# EAGLE schematic AlarmClock (EAGLE 9.6.2)
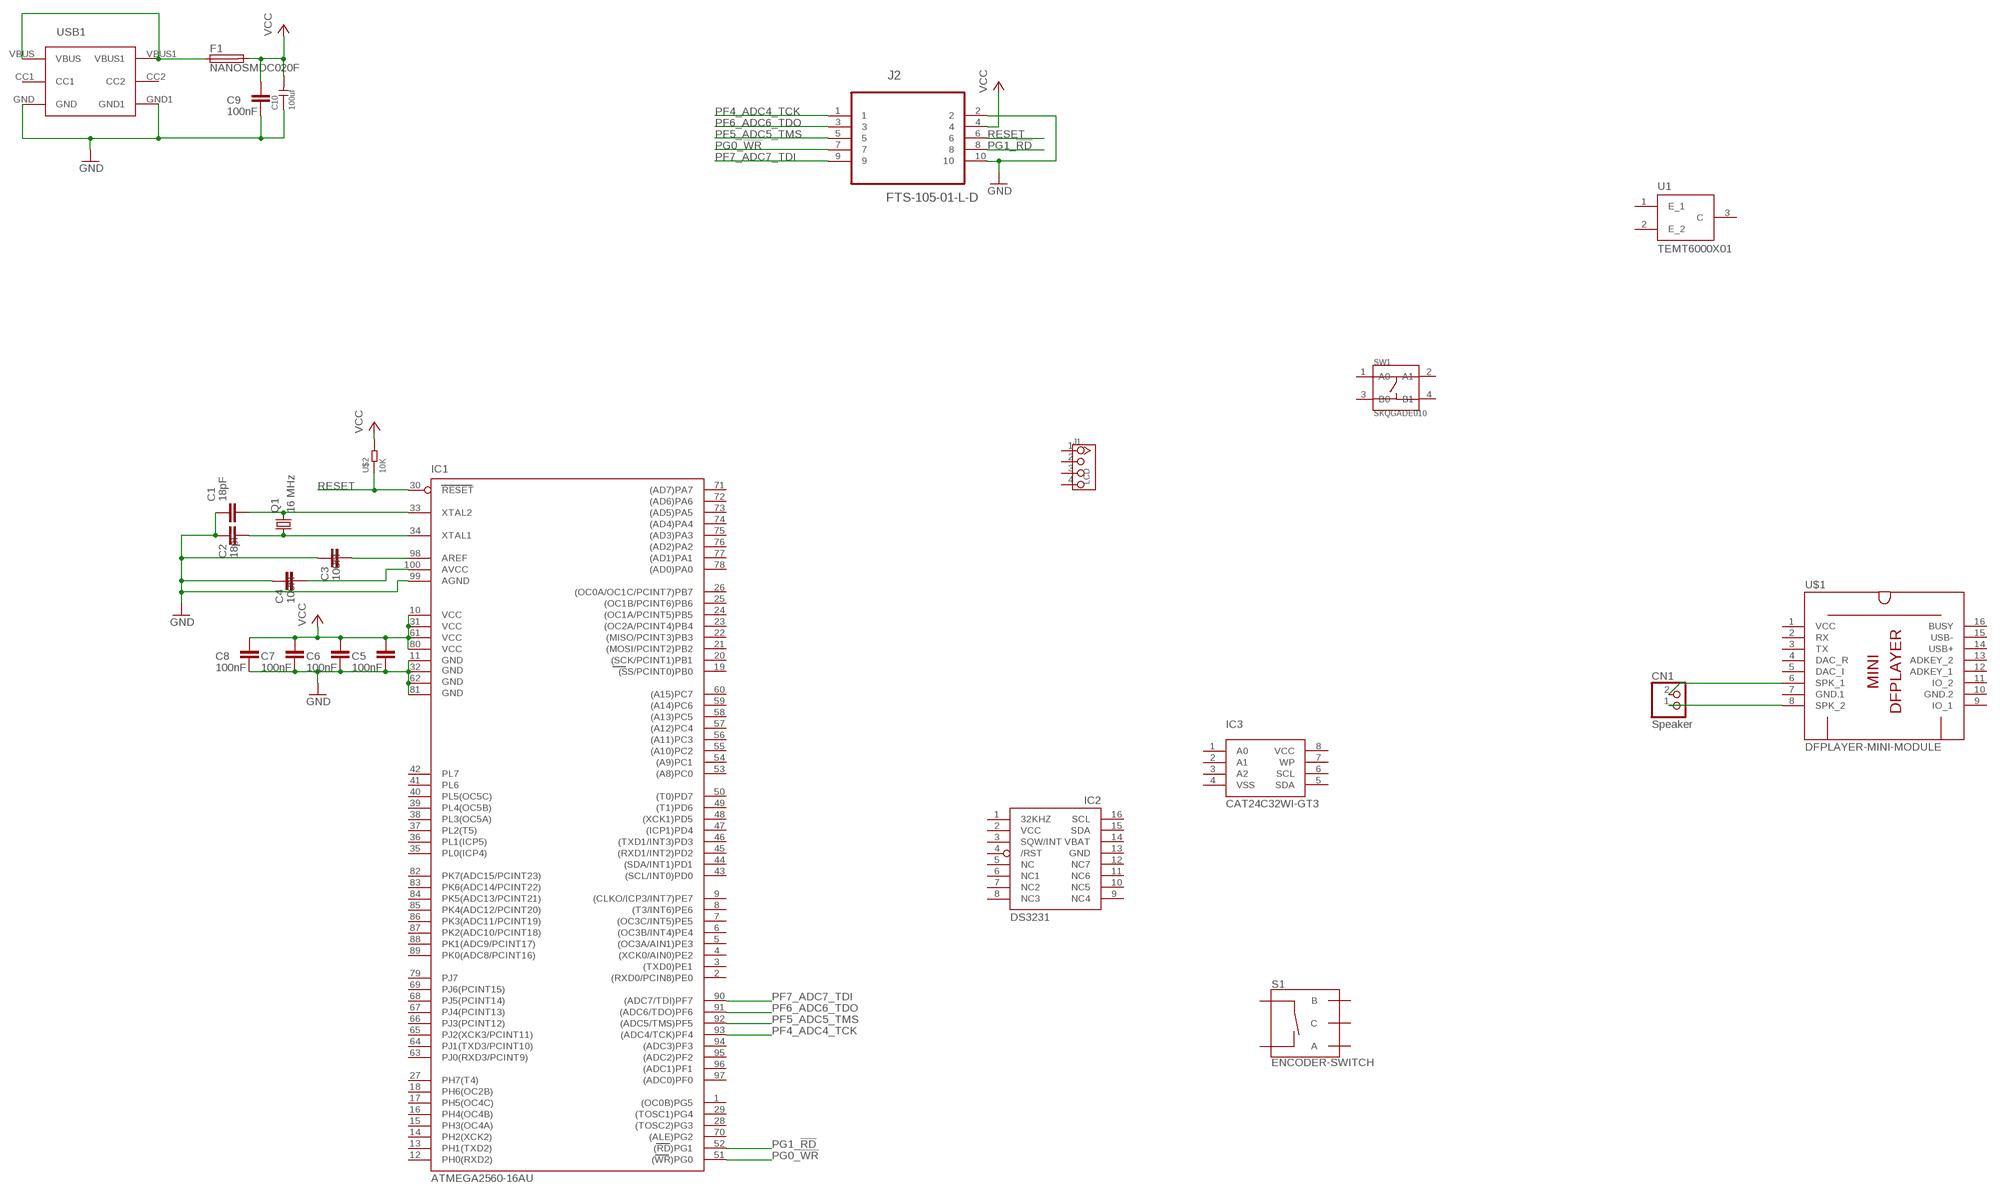
[diagram p0: schematic, sheet 1]

## Parts
C1  18pF  C_CHIP-0805(2012-METRIC)  [CAPC2012X110]
C2  18pF  C_CHIP-0805(2012-METRIC)  [CAPC2012X110]
C3  100nF  C_CHIP-0805(2012-METRIC)  [CAPC2012X110]
C4  100nF  C_CHIP-0805(2012-METRIC)  [CAPC2012X110]
C5  100nF  C_CHIP-0805(2012-METRIC)  [CAPC2012X110]
C6  100nF  C_CHIP-0805(2012-METRIC)  [CAPC2012X110]
C7  100nF  C_CHIP-0805(2012-METRIC)  [CAPC2012X110]
C8  100nF  C_CHIP-0805(2012-METRIC)  [CAPC2012X110]
C9  100nF  C_CHIP-0805(2012-METRIC)  [CAPC2012X110]
C10  100uf  CERAMIC-100UF-6.3V-20%-X5R(1206)  [C1206]
CN1  Speaker  JST_2PIN-THM  [JST-PH-2-THM]
F1  NANOSMDC020F  FUSE_NANOSMDC020F-2_CHIP-1206  [FUSC3215X82N]
IC1  ATMEGA2560-16AU  [TQFP100]
IC2  DS3231/SO  [SO16W]
IC3  CAT24C32WI-GT3  [SOIC8]
J1  LCD  TWIG-4P-2.0  [4P-2.0-W/O-BUCKLE]
J2  FTS-105-01-L-D  [SAMTEC_FTS-105-01-L-D]
Q1  16 MHz  CRYSTALHC49UP  [HC49UP]
S1  ENCODER-SWITCH  [ROTARY_ENC_PLAIN]
SW1  SKQGADE010  SMD-BUTTON(4P-5.2X5.2X1.5MM-SKQGADE010)-SKQGADE010  [SW4-SMD-5.2X5.2X1.5MM]
U1  TEMT6000X01  [1206]
U$1  DFPLAYER-MINI-MODULE  [DFPLAYER-MINI-MODULE]
U$2  10K  SMD-RES-10K-1%-1/8W(0805)  [R0805]
USB1  USB_TYPE_C  [USB_TYPE_C]

## Nets
GND [POWER]: C1.1 C2.1 C3.1 C4.1 C5.2 C6.2 C7.2 C8.2 C9.2 C10.1 IC1.11(GND) IC1.32(GND1) IC1.62(GND2) IC1.81(GND3) IC1.99(AGND) J2.2 J2.10 USB1.GND USB1.GND1
N$1: CN1.2 U$1.6(SPK_1)
N$2: CN1.1 U$1.8(SPK_2)
N$4: C2.2 IC1.34(XTAL1) Q1.1
N$5: C1.2 IC1.33(XTAL2) Q1.2
N$6: C4.2 IC1.100(AVCC)
N$7: C3.2 IC1.98(AREF)
N$8: F1.1 USB1.VBUS USB1.VBUS1
PF4_ADC4_TCK: IC1.93((ADC4/TCK)PF4) J2.1
PF5_ADC5_TMS: IC1.92((ADC5/TMS)PF5) J2.5
PF6_ADC6_TDO: IC1.91((ADC6/TDO)PF6) J2.3
PF7_ADC7_TDI: IC1.90((ADC7/TDI)PF7) J2.9
PG0_!WR: IC1.51((WR)PG0) J2.7
PG1_!RD: IC1.52((RD)PG1) J2.8
RESET: IC1.30(RESET) J2.6 U$2.1
VCC [POWER]: C5.1 C6.1 C7.1 C8.1 C9.1 C10.2 F1.2 IC1.10(VCC) IC1.31(VCC1) IC1.61(VCC2) IC1.80(VCC3) J2.4 U$2.2
Unconnected: IC1.1((OC0B)PG5) IC1.2((RXD0/PCIN8)PE0) IC1.3((TXD0)PE1) IC1.4((XCK0/AIN0)PE2) IC1.5((OC3A/AIN1)PE3) IC1.6((OC3B/INT4)PE4) IC1.7((OC3C/INT5)PE5) IC1.8((T3/INT6)PE6) IC1.9((CLKO/ICP3/INT7)PE7) IC1.12(PH0(RXD2)) IC1.13(PH1(TXD2)) IC1.14(PH2(XCK2)) IC1.15(PH3(OC4A)) IC1.16(PH4(OC4B)) IC1.17(PH5(OC4C)) IC1.18(PH6(OC2B)) IC1.19((SS/PCINT0)PB0) IC1.20((SCK/PCINT1)PB1) IC1.21((MOSI/PCINT2)PB2) IC1.22((MISO/PCINT3)PB3) IC1.23((OC2A/PCINT4)PB4) IC1.24((OC1A/PCINT5)PB5) IC1.25((OC1B/PCINT6)PB6) IC1.26((OC0A/OC1C/PCINT7)PB7) IC1.27(PH7(T4)) IC1.28((TOSC2)PG3) IC1.29((TOSC1)PG4) IC1.35(PL0(ICP4)) IC1.36(PL1(ICP5)) IC1.37(PL2(T5)) IC1.38(PL3(OC5A)) IC1.39(PL4(OC5B)) IC1.40(PL5(OC5C)) IC1.41(PL6) IC1.42(PL7) IC1.43((SCL/INT0)PD0) IC1.44((SDA/INT1)PD1) IC1.45((RXD1/INT2)PD2) IC1.46((TXD1/INT3)PD3) IC1.47((ICP1)PD4) IC1.48((XCK1)PD5) IC1.49((T1)PD6) IC1.50((T0)PD7) IC1.53((A8)PC0) IC1.54((A9)PC1) IC1.55((A10)PC2) IC1.56((A11)PC3) IC1.57((A12)PC4) IC1.58((A13)PC5) IC1.59((A14)PC6) IC1.60((A15)PC7) IC1.63(PJ0(RXD3/PCINT9)) IC1.64(PJ1(TXD3/PCINT10)) IC1.65(PJ2(XCK3/PCINT11)) IC1.66(PJ3(PCINT12)) IC1.67(PJ4(PCINT13)) IC1.68(PJ5(PCINT14)) IC1.69(PJ6(PCINT15)) IC1.70((ALE)PG2) IC1.71((AD7)PA7) IC1.72((AD6)PA6) IC1.73((AD5)PA5) IC1.74((AD4)PA4) IC1.75((AD3)PA3) IC1.76((AD2)PA2) IC1.77((AD1)PA1) IC1.78((AD0)PA0) IC1.79(PJ7) IC1.82(PK7(ADC15/PCINT23)) IC1.83(PK6(ADC14/PCINT22)) IC1.84(PK5(ADC13/PCINT21)) IC1.85(PK4(ADC12/PCINT20)) IC1.86(PK3(ADC11/PCINT19)) IC1.87(PK2(ADC10/PCINT18)) IC1.88(PK1(ADC9/PCINT17)) IC1.89(PK0(ADC8/PCINT16)) IC1.94((ADC3)PF3) IC1.95((ADC2)PF2) IC1.96((ADC1)PF1) IC1.97((ADC0)PF0) IC2.1(32KHZ) IC2.3(SQW/INT) IC2.4(/RST) IC2.5(NC) IC2.6(NC1) IC2.7(NC2) IC2.8(NC3) IC2.9(NC4) IC2.10(NC5) IC2.11(NC6) IC2.12(NC7) IC2.15(SDA) IC2.16(SCL) IC3.1(A0) IC3.2(A1) IC3.3(A2) IC3.5(SDA) IC3.6(SCL) IC3.7(WP) J1.1 J1.2 J1.3 J1.4 S1.A S1.B S1.C S1.SW+ S1.SW- SW1.1(A0) SW1.2(A1) SW1.3(B0) SW1.4(B1) U1.1(E_1) U1.2(E_2) U1.3(C) U$1.2(RX) U$1.3(TX) U$1.4(DAC_R) U$1.5(DAC_I) U$1.9(IO_1) U$1.11(IO_2) U$1.12(ADKEY_1) U$1.13(ADKEY_2) U$1.14(USB+) U$1.15(USB-) U$1.16(BUSY)

## Power pins joined to a net without a drawn wire
CC1: USB1.CC1
CC2: USB1.CC2
GND: IC2.13(GND)
GND.1: U$1.7(GND.1)
GND.2: U$1.10(GND.2)
VBAT: IC2.14(VBAT)
VCC: IC2.2(VCC) IC3.8(VCC) U$1.1(VCC)
VSS: IC3.4(VSS)

## Library data of the parts
C1-C9 = Capacitor:C: Capacitor - Generic; CATEGORY: Capacitor
C10 = OPL_Capacitor:CERAMIC-100UF-6.3V-20%-X5R(1206): 302010183; MPN: GRM31CR60J107ME39L
CN1 = adafruit:JST_2PIN: JST 2-Pin Connectors of various flavors SMT-RA (S2B-PH-SM4) 4UConnector #17311 SMT (B2B-PH-SM4) THM-RA (S2B-PH) THM (B2B-PH)
F1 = Circuit-Protection:FUSE_: Fuse - Popular parts; CATEGORY: Circuit-Protection; DESCRIPTION: PTC RESET FUSE 24V 200MA 1206; MANUFACTURER: Littelfuse Inc.; MPN: NANOSMDC020F-2; SUB-CATEGORY: Fuse
IC1 = atmel-2005:ATMEGA*: MICROCONTROLLER 64/128/256 Kbytes FLASH 4 Kbytes EEPROM 8 Kbytes SRAM 86 General Purpose I/O pins 12-channels16-bit PWM 4 x Serial USARTs 16-channels 10-bit A/D
IC2 = adafruit:DS3231
IC3 = Memory:CAT24C32WI-GT3: IC EEPROM 32K I2C 1MHZ 8SOIC Manufacturer's datasheet <https://www.onsemi.com/pub/Collateral/CAT24C32-D.PDF>; CREATED_BY: PCBLayout.com; DIGIKEY_PART_NUMBER: CAT24C32WI-GT3CT-ND; MANUFACTURER: ON Semiconductor; MPN: CAT24C32WI-GT3; PACKAGE: SOIC-8
J1 = Connector:TWIG-4P-2.0
J2 = JTAG_10pol_50mil-MSW193:FTS-105-01-L-D; DESCRIPTION: CONN HEADER, 1.27MM, THRU HOLE, 10WAY; MPN: FTS-105-01-L-D; OCFARNELL: 1667728; OCNEWARK: 11P4652; PACKAGE: HEADER, 1.27MM, THRU HOLE, 10WAY; SUPPLIER: Samtec
Q1 = adafruit:CRYSTAL: CRYSTAL; OC_FARNELL: unknown; OC_NEWARK: unknown
S1 = SparkFun-Switches:ENCODER-SWITCH: Rotary Encoder w/ Select Switch Encoders rotate similarly to potentiometers, but they’re different from potentiometers in that an encoder has full rotation without limits. They output gray code so that you can tell how much and in which direction the encoder has been turned. This encoder includes a push-down select switch built into the shaft. SparkFun Products Rotary Encoder <https://www.sparkfun.com/products/9117> (COM-09117); SF_SKU: COM-09117
SW1 = OPL_Switch:SMD-BUTTON(4P-5.2X5.2X1.5MM-SKQGADE010): 311020017; MPN: SKQGADE010
U1 = Sensor:TEMT6000X01: SENSOR PHOTO 570NM TOP VIEW 1206 Manufacturer's datasheet <http://www.vishay.com/docs/81579/temt6000.pdf>; CREATED_BY: PCBLayout.com; DIGI_KEY_PART_NUMBER: 751-1055-1-ND; MANUFACTURER: Vishay Semiconductor Opto Division; MPN: TEMT6000X01; PACKAGE: 1206
U$1 = diy-modules:DFPLAYER-MINI-MODULE: DFPlayer Mini - MP3 player module based on YX5200 chip More details available here: https://www.dfrobot.com/wiki/index.php/DFPlayer_Mini_SKU:DFR0299 Click here to find device on ebay.com <http://www.ebay.com/sch/dfplayer+mini>
U$2 = OPL_Resistor:SMD-RES-10K-1%-1/8W(0805): 301012152; MPN: RC0805FR-0710KL
USB1 = Usb_c:USB_TYPE_C

## Net classes
0 default: width 0.305 mm, drill 0.61 mm
1 POWER: width 0.61 mm, drill 0.61 mm